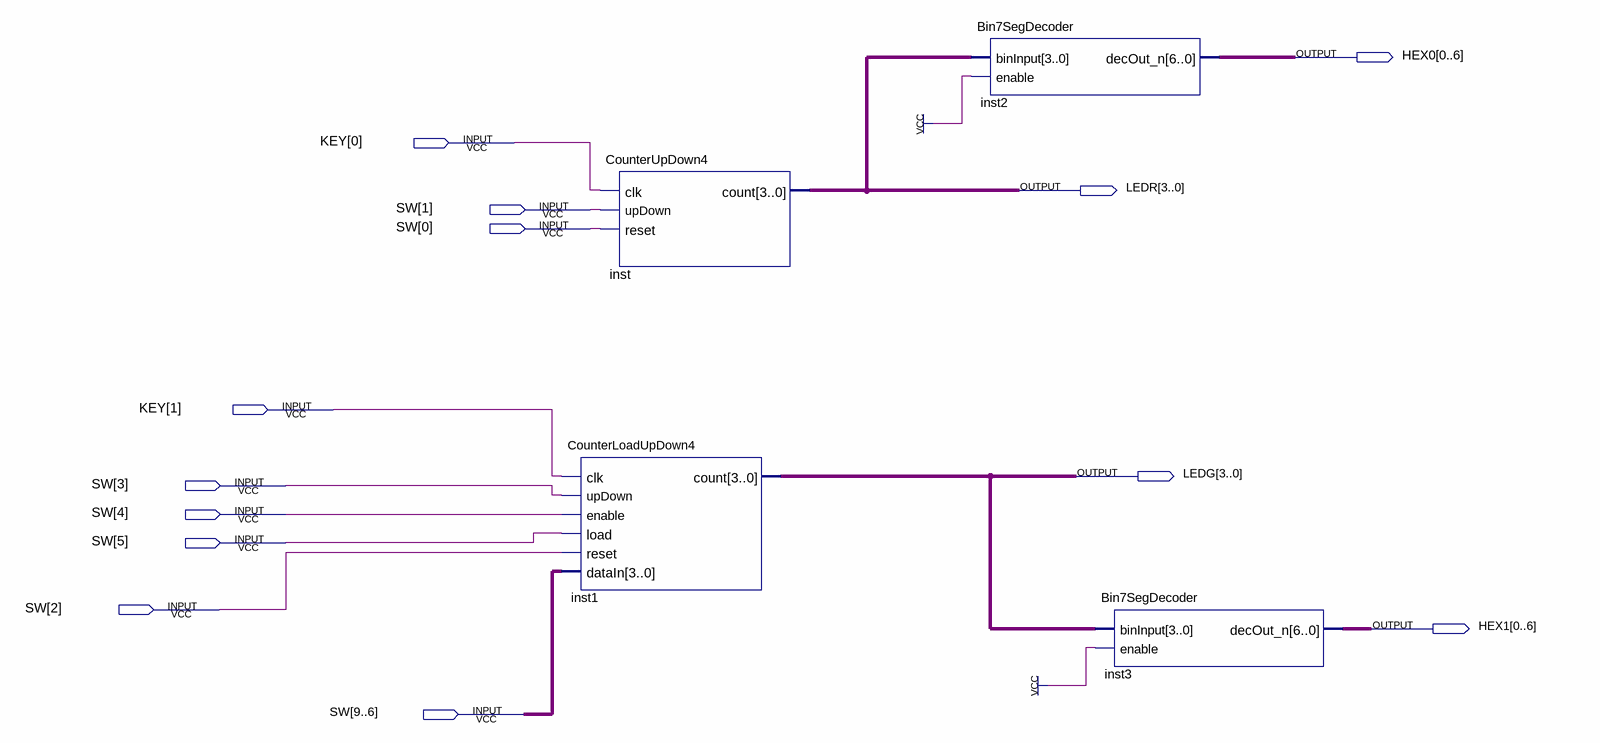
[diagram p0: schematic sheet]
// Quartus schematic Counter_Demo.bdf as structural Verilog: 4 symbols, 13 pins
module Counter_Demo (
  input  [1:0] KEY,
  input  [9:0] SW,
  output [0:6] HEX0,
  output [3:0] LEDR,
  output [3:0] LEDG,
  output [0:6] HEX1
);

  CounterUpDown4 inst (.clk(KEY[0]), .upDown(SW[1]), .reset(SW[0]), .count(LEDR));
  CounterLoadUpDown4 inst1 (
    .clk(KEY[1]), .upDown(SW[3]), .enable(SW[4]), .load(SW[5]), .reset(SW[2]), .dataIn(SW[9:6]), .count(LEDG));
  Bin7SegDecoder inst2 (.binInput(LEDR), .enable(1'b1), .decOut_n(HEX0));
  Bin7SegDecoder inst3 (.binInput(LEDG), .enable(1'b1), .decOut_n(HEX1));
endmodule
